# EAGLE design NeoPixel-WS2812B-2020 (EAGLE 7.6.0)
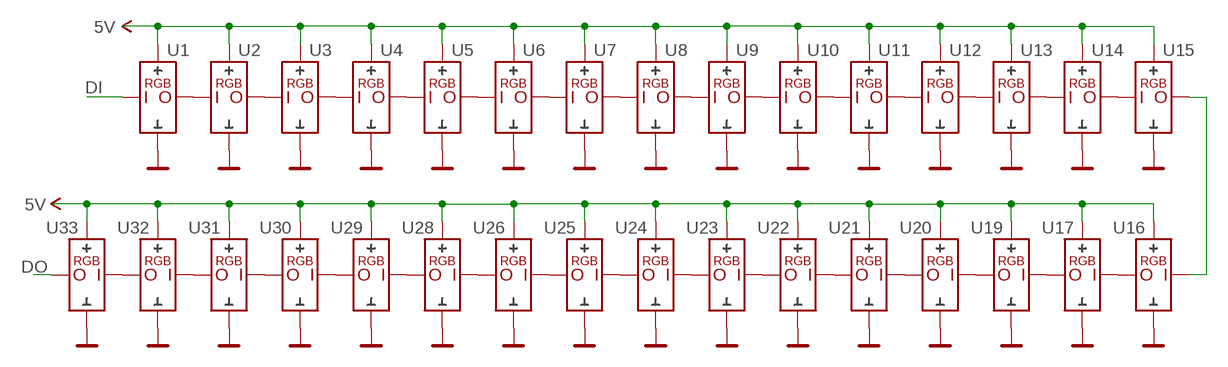
[diagram p0: schematic, sheet 1]
V1 (ARROW): VALUE: x
V7 (ARROW): VALUE: x

## Parts
U1  LED-ADDRESSABLE16MM  [LED-WS2812B-2020-RING]
U2  LED-ADDRESSABLE16MM  [LED-WS2812B-2020-RING]
U3  LED-ADDRESSABLE16MM  [LED-WS2812B-2020-RING]
U4  LED-ADDRESSABLE16MM  [LED-WS2812B-2020-RING]
U5  LED-ADDRESSABLE16MM  [LED-WS2812B-2020-RING]
U6  LED-ADDRESSABLE16MM  [LED-WS2812B-2020-RING]
U7  LED-ADDRESSABLE16MM  [LED-WS2812B-2020-RING]
U8  LED-ADDRESSABLE16MM  [LED-WS2812B-2020-RING]
U9  LED-ADDRESSABLE16MM  [LED-WS2812B-2020-RING]
U10  LED-ADDRESSABLE16MM  [LED-WS2812B-2020-RING]
U11  LED-ADDRESSABLE16MM  [LED-WS2812B-2020-RING]
U12  LED-ADDRESSABLE16MM  [LED-WS2812B-2020-RING]
U13  LED-ADDRESSABLE16MM  [LED-WS2812B-2020-RING]
U14  LED-ADDRESSABLE16MM  [LED-WS2812B-2020-RING]
U15  LED-ADDRESSABLE16MM  [LED-WS2812B-2020-RING]
U16  LED-ADDRESSABLE16MM  [LED-WS2812B-2020-RING]
U17  LED-ADDRESSABLE16MM  [LED-WS2812B-2020-RING]
U19  LED-ADDRESSABLE16MM  [LED-WS2812B-2020-RING]
U20  LED-ADDRESSABLE16MM  [LED-WS2812B-2020-RING]
U21  LED-ADDRESSABLE16MM  [LED-WS2812B-2020-RING]
U22  LED-ADDRESSABLE16MM  [LED-WS2812B-2020-RING]
U23  LED-ADDRESSABLE16MM  [LED-WS2812B-2020-RING]
U24  LED-ADDRESSABLE16MM  [LED-WS2812B-2020-RING]
U25  LED-ADDRESSABLE16MM  [LED-WS2812B-2020-RING]
U26  LED-ADDRESSABLE16MM  [LED-WS2812B-2020-RING]
U28  LED-ADDRESSABLE16MM  [LED-WS2812B-2020-RING]
U29  LED-ADDRESSABLE16MM  [LED-WS2812B-2020-RING]
U30  LED-ADDRESSABLE16MM  [LED-WS2812B-2020-RING]
U31  LED-ADDRESSABLE16MM  [LED-WS2812B-2020-RING]
U32  LED-ADDRESSABLE16MM  [LED-WS2812B-2020-RING]
U33  LED-ADDRESSABLE16MM  [LED-WS2812B-2020-RING]

## Nets
5V: U1.+(VDD) U2.+(VDD) U3.+(VDD) U4.+(VDD) U5.+(VDD) U6.+(VDD) U7.+(VDD) U8.+(VDD) U9.+(VDD) U10.+(VDD) U11.+(VDD) U12.+(VDD) U13.+(VDD) U14.+(VDD) U15.+(VDD) U16.+(VDD) U17.+(VDD) U19.+(VDD) U20.+(VDD) U21.+(VDD) U22.+(VDD) U23.+(VDD) U24.+(VDD) U25.+(VDD) U26.+(VDD) U28.+(VDD) U29.+(VDD) U30.+(VDD) U31.+(VDD) U32.+(VDD) U33.+(VDD)
DI: U1.DI
DO: U33.DO
GND: U1.GND U2.GND U3.GND U4.GND U5.GND U6.GND U7.GND U8.GND U9.GND U10.GND U11.GND U12.GND U13.GND U14.GND U15.GND U16.GND U17.GND U19.GND U20.GND U21.GND U22.GND U23.GND U24.GND U25.GND U26.GND U28.GND U29.GND U30.GND U31.GND U32.GND U33.GND
N$1: U32.DO U33.DI
N$2: U31.DO U32.DI
N$3: U28.DO U29.DI
N$4: U29.DO U30.DI
N$5: U30.DO U31.DI
N$6: U19.DO U20.DI
N$7: U25.DO U26.DI
N$8: U24.DO U25.DI
N$9: U21.DO U22.DI
N$10: U22.DO U23.DI
N$11: U23.DO U24.DI
N$12: U17.DO U19.DI
N$13: U14.DO U15.DI
N$14: U13.DO U14.DI
N$15: U16.DO U17.DI
N$16: U10.DO U11.DI
N$17: U11.DO U12.DI
N$18: U12.DO U13.DI
N$19: U8.DO U9.DI
N$20: U7.DO U8.DI
N$21: U4.DO U5.DI
N$22: U5.DO U6.DI
N$23: U6.DO U7.DI
N$24: U2.DO U3.DI
N$25: U1.DO U2.DI
N$26: U9.DO U10.DI
N$27: U26.DO U28.DI
N$28: U20.DO U21.DI
N$29: U15.DO U16.DI
N$30: U3.DO U4.DI

## Library data of the parts
U1-U17 U19-U26 U28-U33 = ALBERT:LED-ADDRESSABLE

## Board
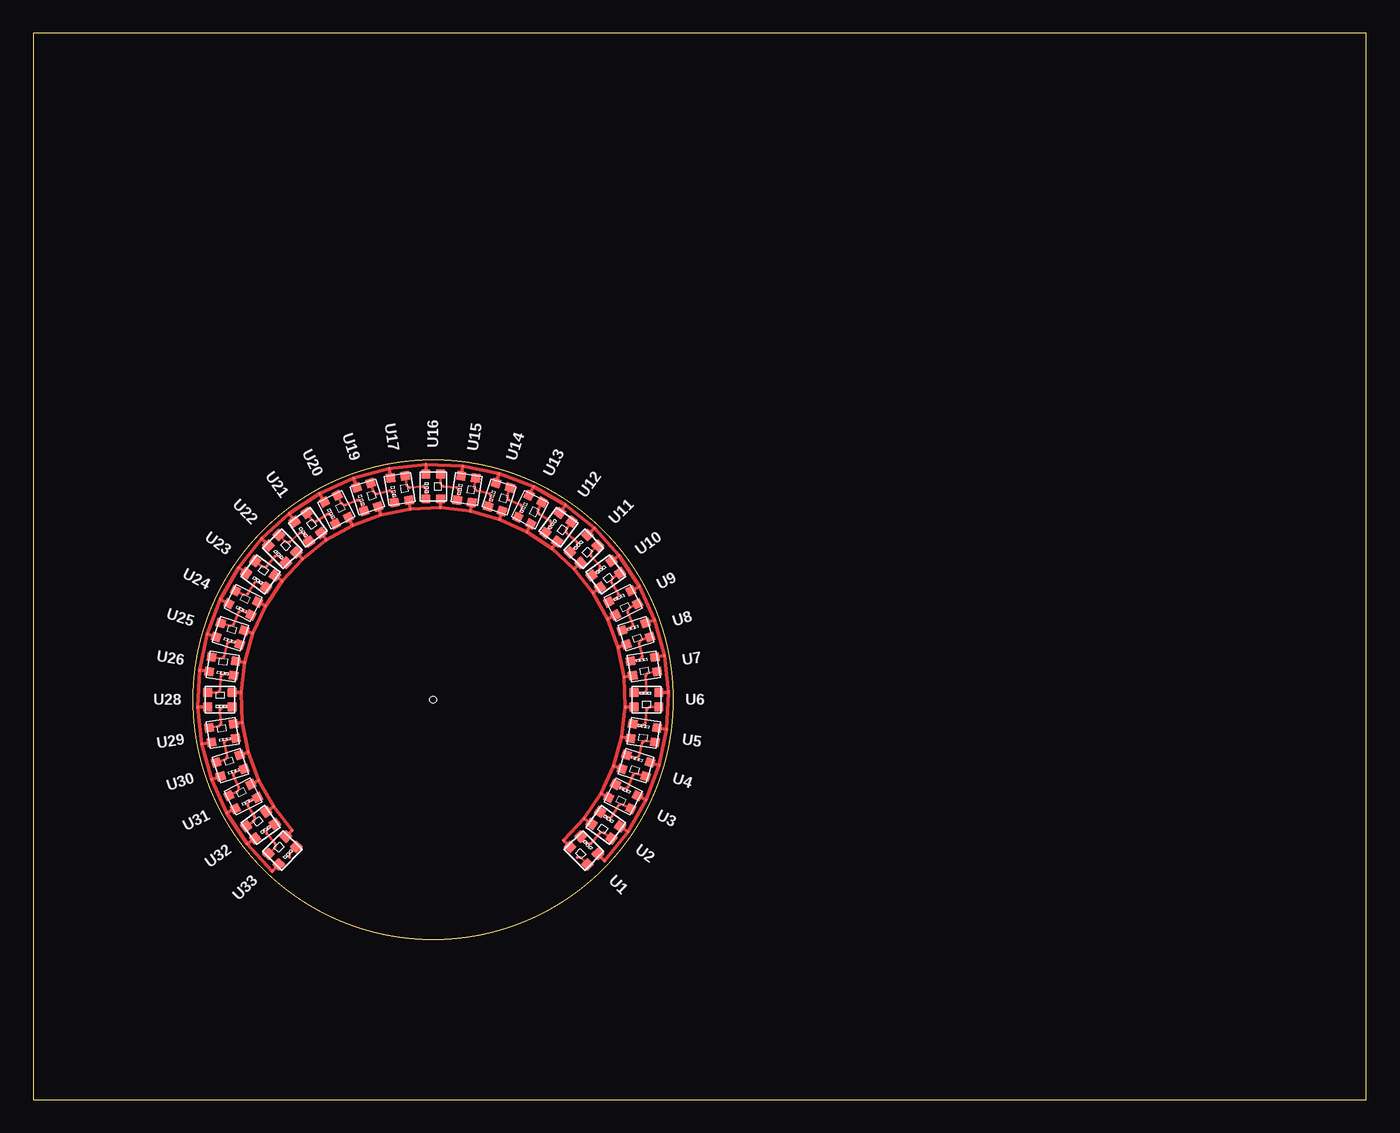
[diagram p1: board, top side]

Size 100 x 80 mm. Coordinates in mm from the lower left corner, seen from the top.
Outline: 0,0 100,0 100,80 0,80 0,0
Outline: circle at 30,30 radius 18
Copper layers (1*16): Top 0.035mm / dielectric 1.5mm / Bottom 0.035mm
Design rules "Albert 5mil": minimum track width 5mil, minimum drill 0.3mm, track to track 5mil, track to pad 5mil, pad to pad 5mil, via to via 5mil, smd to smd 5mil, copper to edge 10mil, drill to drill 8mil, minimum pad ring 8.5mil, minimum via ring 6mil, stop-mask expansion 4mil, vias tented up to drill 25mil, thermal gap 10mil

### Footprints (pad centres in the part's own frame; a part is rotated, then mirrored left to right if it is on the bottom)
LED-WS2812B-2020-RING = smd 0.127 x 0.127: + -17.655,-0.55; DI -16,0.75; DO -16.005,-0.75; GND -14.405,0.55 | smd 0.7 x 0.7: +1 -16.925,-0.55; DI1 -16.925,0.55; DO1 -15.075,-0.55; GND1 -15.075,0.55

### Placement (x,y rotation side)
U1  30,30 135 top
U2  30,30 144 top
U3  30,30 153 top
U4  30,30 162 top
U5  30,30 171 top
U6  30,30 180 top
U7  30,30 189 top
U8  30,30 198 top
U9  30,30 207 top
U10  30,30 216 top
U11  30,30 225 top
U12  30,30 234 top
U13  30,30 243 top
U14  30,30 252 top
U15  30,30 261 top
U16  30,30 270 top
U17  30,30 279 top
U19  30,30 288 top
U20  30,30 297 top
U21  30,30 306 top
U22  30,30 315 top
U23  30,30 324 top
U24  30,30 333 top
U25  30,30 342 top
U26  30,30 351 top
U28  30,30 0 top
U29  30,30 9 top
U30  30,30 18 top
U31  30,30 27 top
U32  30,30 36 top
U33  30,30 45 top

### Tracks (layer width: path | path; a pad name or v marks a point on that pad's centre or on a via)
5V
  Top 0.254: U33.+ U32.+ U31.+ U30.+ U29.+ U28.+ U26.+ U25.+ U24.+ U23.+ U22.+ U21.+ U20.+ U19.+ U17.+ U16.+ U15.+ U14.+ U13.+ U12.+ U11.+ U10.+ U9.+ U8.+ U7.+ U6.+ U5.+ U4.+ U3.+ U2.+ U1.+
GND
  Top 0.254: U33.GND U32.GND U31.GND U30.GND U29.GND U28.GND U26.GND U25.GND U24.GND U23.GND U22.GND U21.GND U20.GND U19.GND U17.GND U16.GND U15.GND U14.GND U13.GND U12.GND U11.GND U10.GND U9.GND U8.GND U7.GND U6.GND U5.GND U4.GND U3.GND U2.GND U1.GND
N$1
  Top 0.203: U32.DO U33.DI
N$2
  Top 0.203: U31.DO U32.DI
N$3
  Top 0.203: U28.DO U29.DI
N$4
  Top 0.203: U29.DO U30.DI
N$5
  Top 0.203: U30.DO U31.DI
N$6
  Top 0.203: U20.DI U19.DO
N$7
  Top 0.203: U25.DO U26.DI
N$8
  Top 0.203: U25.DI U24.DO
N$9
  Top 0.203: U22.DI U21.DO
N$10
  Top 0.203: U23.DI U22.DO
N$11
  Top 0.203: U24.DI U23.DO
N$12
  Top 0.203: U19.DI U17.DO
N$13
  Top 0.203: U15.DI U14.DO
N$14
  Top 0.203: U14.DI U13.DO
N$15
  Top 0.203: U17.DI U16.DO
N$16
  Top 0.203: U11.DI U10.DO
N$17
  Top 0.203: U12.DI U11.DO
N$18
  Top 0.203: U13.DI U12.DO
N$19
  Top 0.203: U9.DI U8.DO
N$20
  Top 0.203: U8.DI U7.DO
N$21
  Top 0.203: U5.DI U4.DO
N$22
  Top 0.203: U6.DI U5.DO
N$23
  Top 0.203: U7.DI U6.DO
N$24
  Top 0.203: U3.DI U2.DO
N$25
  Top 0.203: U2.DI U1.DO
N$26
  Top 0.203: U10.DI U9.DO
N$27
  Top 0.203: U28.DI U26.DO
N$28
  Top 0.203: U21.DI U20.DO
N$29
  Top 0.203: U16.DI U15.DO
N$30
  Top 0.203: U4.DI U3.DO